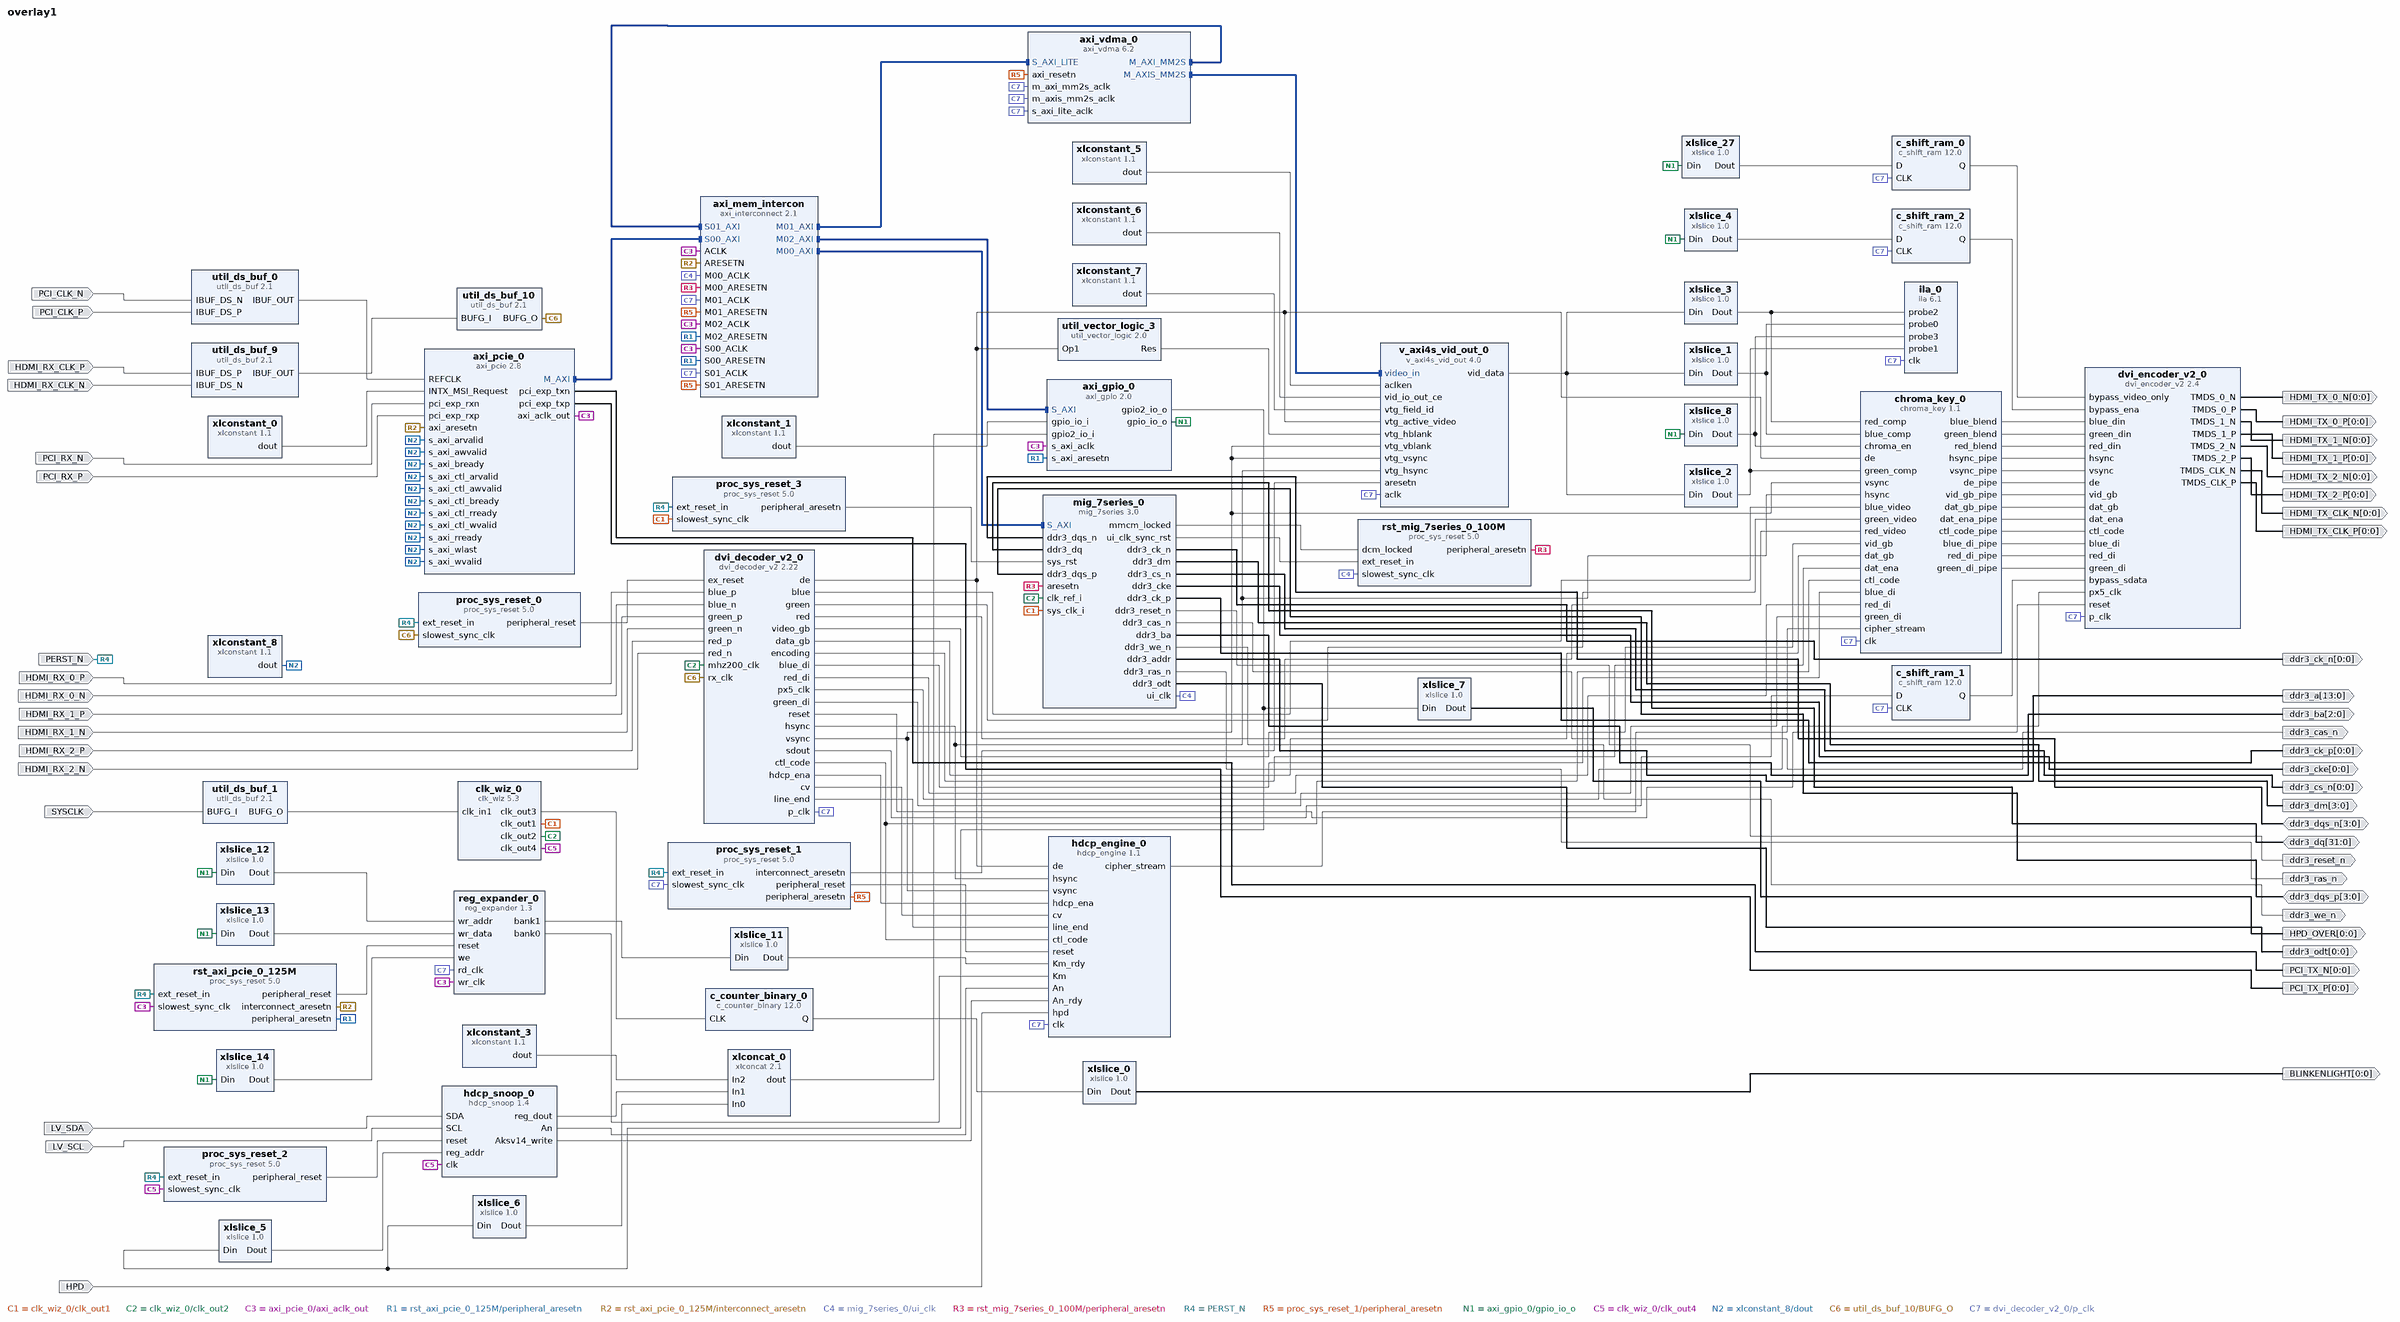
[diagram p0: block diagram of the top level]
# Vivado block design overlay1, Vivado 2016.1
create_bd_design overlay1

create_bd_port -dir O -from 3 -to 0 ddr3_dm
create_bd_port -dir O -from 0 -to 0 ddr3_cs_n
create_bd_port -dir O -from 0 -to 0 -type ce ddr3_cke
create_bd_port -dir O -from 0 -to 0 ddr3_ck_n
create_bd_port -dir O -from 0 -to 0 -type clk ddr3_ck_p
create_bd_port -dir O ddr3_reset_n
create_bd_port -dir O ddr3_we_n
create_bd_port -dir O ddr3_cas_n
create_bd_port -dir O ddr3_ras_n
create_bd_port -dir O -from 2 -to 0 ddr3_ba
create_bd_port -dir O -from 13 -to 0 ddr3_a
create_bd_port -dir IO -from 3 -to 0 ddr3_dqs_n
create_bd_port -dir O -from 0 -to 0 ddr3_odt
create_bd_port -dir I -type clk PCI_CLK_N
set_property -dict {CONFIG.FREQ_HZ 100000000} [get_bd_ports PCI_CLK_N]
create_bd_port -dir I -type clk PCI_CLK_P
set_property -dict {CONFIG.FREQ_HZ 100000000} [get_bd_ports PCI_CLK_P]
create_bd_port -dir I -type clk SYSCLK
set_property -dict {CONFIG.FREQ_HZ 50000000} [get_bd_ports SYSCLK]
create_bd_port -dir I -type rst PERST_N
create_bd_port -dir I PCI_RX_N
create_bd_port -dir I PCI_RX_P
create_bd_port -dir O -from 0 -to 0 PCI_TX_N
create_bd_port -dir O -from 0 -to 0 PCI_TX_P
create_bd_port -dir O -from 0 -to 0 BLINKENLIGHT
create_bd_port -dir IO -from 31 -to 0 -type data ddr3_dq
create_bd_port -dir IO -from 3 -to 0 ddr3_dqs_p
create_bd_port -dir I HDMI_RX_CLK_P
create_bd_port -dir I HDMI_RX_CLK_N
create_bd_port -dir I LV_SDA
create_bd_port -dir I LV_SCL
create_bd_port -dir O -from 0 -to 0 HPD_OVER
create_bd_port -dir O -from 0 -to 0 HDMI_TX_0_P
create_bd_port -dir O -from 0 -to 0 HDMI_TX_0_N
create_bd_port -dir O -from 0 -to 0 HDMI_TX_1_P
create_bd_port -dir O -from 0 -to 0 HDMI_TX_1_N
create_bd_port -dir O -from 0 -to 0 HDMI_TX_2_P
create_bd_port -dir O -from 0 -to 0 HDMI_TX_2_N
create_bd_port -dir O -from 0 -to 0 HDMI_TX_CLK_P
create_bd_port -dir O -from 0 -to 0 HDMI_TX_CLK_N
create_bd_port -dir I HDMI_RX_0_P
create_bd_port -dir I HDMI_RX_0_N
create_bd_port -dir I HDMI_RX_1_P
create_bd_port -dir I HDMI_RX_1_N
create_bd_port -dir I HDMI_RX_2_P
create_bd_port -dir I HDMI_RX_2_N
create_bd_port -dir I HPD

create_bd_cell -type ip -vlnv xilinx.com:ip:axi_pcie:2.8 axi_pcie_0
set_property -dict [list \
  CONFIG.MAX_LINK_SPEED 5.0_GT/s \
  CONFIG.DEVICE_ID 0x7021 \
  CONFIG.BAR1_ENABLED true \
  CONFIG.BAR2_ENABLED true \
  CONFIG.BAR1_TYPE Memory \
  CONFIG.BAR2_TYPE Memory \
  CONFIG.BAR0_SCALE Megabytes \
  CONFIG.BAR1_SCALE Kilobytes \
  CONFIG.BAR2_SCALE Kilobytes \
  CONFIG.BAR0_SIZE 8 \
  CONFIG.BAR1_SIZE 128 \
  CONFIG.BAR2_SIZE 64 \
  CONFIG.PCIEBAR2AXIBAR_1 0x44A00000 \
  CONFIG.PCIEBAR2AXIBAR_2 0x40000000 \
  CONFIG.AXIBAR_AS_0 false \
  CONFIG.AXIBAR_AS_1 true \
  CONFIG.S_AXI_DATA_WIDTH 64 \
  CONFIG.M_AXI_DATA_WIDTH 64 \
  CONFIG.S_AXI_SUPPORTS_NARROW_BURST true \
  CONFIG.BAR_64BIT true \
  CONFIG.AXIBAR_NUM 1 \
  CONFIG.shared_logic_in_core true \
  CONFIG.en_transceiver_status_ports true \
] [get_bd_cells axi_pcie_0]
create_bd_cell -type ip -vlnv xilinx.com:ip:mig_7series:3.0 mig_7series_0
set_property -dict [list \
  CONFIG.XML_INPUT_FILE mig_b.prj \
  CONFIG.RESET_BOARD_INTERFACE Custom \
  CONFIG.MIG_DONT_TOUCH_PARAM Custom \
  CONFIG.BOARD_MIG_PARAM Custom \
] [get_bd_cells mig_7series_0]
create_bd_cell -type ip -vlnv xilinx.com:ip:clk_wiz:5.3 clk_wiz_0
set_property -dict [list \
  CONFIG.PRIM_IN_FREQ 50 \
  CONFIG.CLKIN1_JITTER_PS 200.0 \
  CONFIG.CLKOUT1_USED true \
  CONFIG.CLKOUT2_USED true \
  CONFIG.CLKOUT3_USED true \
  CONFIG.CLKOUT4_USED true \
  CONFIG.NUM_OUT_CLKS 4 \
  CONFIG.CLKOUT1_REQUESTED_OUT_FREQ 400 \
  CONFIG.CLKOUT2_REQUESTED_OUT_FREQ 200 \
  CONFIG.CLKOUT3_REQUESTED_OUT_FREQ 50 \
  CONFIG.CLKOUT4_REQUESTED_OUT_FREQ 25 \
  CONFIG.USE_LOCKED false \
  CONFIG.USE_RESET false \
  CONFIG.RESET_PORT resetn \
  CONFIG.MMCM_DIVCLK_DIVIDE 1 \
  CONFIG.MMCM_CLKFBOUT_MULT_F 20.000 \
  CONFIG.MMCM_CLKIN1_PERIOD 20.0 \
  CONFIG.MMCM_CLKOUT0_DIVIDE_F 2.500 \
  CONFIG.MMCM_CLKOUT1_DIVIDE 5 \
  CONFIG.MMCM_CLKOUT2_DIVIDE 20 \
  CONFIG.MMCM_CLKOUT3_DIVIDE 40 \
  CONFIG.RESET_TYPE ACTIVE_LOW \
  CONFIG.CLKOUT1_JITTER 126.902 \
  CONFIG.CLKOUT1_PHASE_ERROR 164.985 \
  CONFIG.CLKOUT2_JITTER 142.107 \
  CONFIG.CLKOUT2_PHASE_ERROR 164.985 \
  CONFIG.CLKOUT3_JITTER 192.113 \
  CONFIG.CLKOUT3_PHASE_ERROR 164.985 \
  CONFIG.CLKOUT4_JITTER 236.428 \
  CONFIG.CLKOUT4_PHASE_ERROR 164.985 \
] [get_bd_cells clk_wiz_0]
create_bd_cell -type ip -vlnv xilinx.com:ip:util_ds_buf:2.1 util_ds_buf_0
set_property -dict {CONFIG.C_BUF_TYPE IBUFDSGTE} [get_bd_cells util_ds_buf_0]
create_bd_cell -type ip -vlnv xilinx.com:ip:xlconstant:1.1 xlconstant_0
set_property -dict {CONFIG.CONST_VAL 0} [get_bd_cells xlconstant_0]
create_bd_cell -type ip -vlnv xilinx.com:ip:util_ds_buf:2.1 util_ds_buf_1
set_property -dict {CONFIG.C_BUF_TYPE BUFG} [get_bd_cells util_ds_buf_1]
create_bd_cell -type ip -vlnv xilinx.com:ip:axi_interconnect:2.1 axi_mem_intercon
set_property -dict [list \
  CONFIG.NUM_SI 2 \
  CONFIG.NUM_MI 3 \
  CONFIG.STRATEGY 2 \
  CONFIG.ENABLE_ADVANCED_OPTIONS 1 \
  CONFIG.S00_HAS_DATA_FIFO 2 \
  CONFIG.S01_HAS_DATA_FIFO 2 \
] [get_bd_cells axi_mem_intercon]
create_bd_cell -type ip -vlnv xilinx.com:ip:proc_sys_reset:5.0 rst_axi_pcie_0_125M
create_bd_cell -type ip -vlnv xilinx.com:ip:proc_sys_reset:5.0 rst_mig_7series_0_100M
create_bd_cell -type ip -vlnv xilinx.com:ip:c_counter_binary:12.0 c_counter_binary_0
set_property -dict {CONFIG.Output_Width 25 CONFIG.SINIT false} [get_bd_cells c_counter_binary_0]
create_bd_cell -type ip -vlnv xilinx.com:ip:xlslice:1.0 xlslice_0
set_property -dict {CONFIG.DOUT_WIDTH 1 CONFIG.DIN_TO 24 CONFIG.DIN_FROM 24 CONFIG.DIN_WIDTH 25} [get_bd_cells xlslice_0]
create_bd_cell -type ip -vlnv xilinx.com:ip:proc_sys_reset:5.0 proc_sys_reset_0
create_bd_cell -type ip -vlnv xilinx.com:ip:util_ds_buf:2.1 util_ds_buf_9
create_bd_cell -type ip -vlnv xilinx.com:ip:util_ds_buf:2.1 util_ds_buf_10
set_property -dict {CONFIG.C_BUF_TYPE BUFG} [get_bd_cells util_ds_buf_10]
create_bd_cell -type ip -vlnv xilinx.com:ip:axi_vdma:6.2 axi_vdma_0
set_property -dict [list \
  CONFIG.c_m_axis_mm2s_tdata_width 24 \
  CONFIG.c_num_fstores 1 \
  CONFIG.c_use_mm2s_fsync 0 \
  CONFIG.c_mm2s_genlock_mode 0 \
  CONFIG.c_mm2s_linebuffer_depth 512 \
  CONFIG.c_mm2s_max_burst_length 32 \
  CONFIG.c_include_s2mm 0 \
  CONFIG.c_include_mm2s_dre 1 \
] [get_bd_cells axi_vdma_0]
create_bd_cell -type ip -vlnv xilinx.com:ip:v_axi4s_vid_out:4.0 v_axi4s_vid_out_0
set_property -dict [list \
  CONFIG.C_S_AXIS_VIDEO_FORMAT 2 \
  CONFIG.C_HAS_ASYNC_CLK 0 \
  CONFIG.C_ADDR_WIDTH 5 \
  CONFIG.C_VTG_MASTER_SLAVE 1 \
] [get_bd_cells v_axi4s_vid_out_0]
create_bd_cell -type ip -vlnv xilinx.com:ip:xlconstant:1.1 xlconstant_5
create_bd_cell -type ip -vlnv xilinx.com:ip:xlconstant:1.1 xlconstant_6
create_bd_cell -type ip -vlnv xilinx.com:ip:proc_sys_reset:5.0 proc_sys_reset_1
create_bd_cell -type ip -vlnv xilinx.com:ip:axi_gpio:2.0 axi_gpio_0
set_property -dict {CONFIG.C_IS_DUAL 1 CONFIG.C_DOUT_DEFAULT 0x00000001} [get_bd_cells axi_gpio_0]
create_bd_cell -type ip -vlnv xilinx.com:ip:xlslice:1.0 xlslice_4
create_bd_cell -type ip -vlnv xilinx.com:ip:xlconstant:1.1 xlconstant_1
set_property -dict {CONFIG.CONST_WIDTH 32 CONFIG.CONST_VAL 839760574} [get_bd_cells xlconstant_1]
create_bd_cell -type ip -vlnv xilinx.com:ip:xlconstant:1.1 xlconstant_7
set_property -dict {CONFIG.CONST_VAL 0} [get_bd_cells xlconstant_7]
create_bd_cell -type ip -vlnv xilinx.com:ip:xlslice:1.0 xlslice_5
set_property -dict {CONFIG.DOUT_WIDTH 5 CONFIG.DIN_FROM 4} [get_bd_cells xlslice_5]
create_bd_cell -type ip -vlnv xilinx.com:ip:xlslice:1.0 xlslice_6
set_property -dict {CONFIG.DOUT_WIDTH 8 CONFIG.DIN_TO 8 CONFIG.DIN_FROM 15} [get_bd_cells xlslice_6]
create_bd_cell -type ip -vlnv xilinx.com:ip:xlconcat:2.1 xlconcat_0
set_property -dict {CONFIG.NUM_PORTS 3 CONFIG.IN0_WIDTH 8 CONFIG.IN1_WIDTH 8 CONFIG.IN2_WIDTH 16} [get_bd_cells xlconcat_0]
create_bd_cell -type ip -vlnv xilinx.com:ip:xlconstant:1.1 xlconstant_3
set_property -dict {CONFIG.CONST_WIDTH 16 CONFIG.CONST_VAL 47806} [get_bd_cells xlconstant_3]
create_bd_cell -type ip -vlnv xilinx.com:ip:xlslice:1.0 xlslice_7
set_property -dict {CONFIG.DOUT_WIDTH 1 CONFIG.DIN_TO 31 CONFIG.DIN_FROM 31} [get_bd_cells xlslice_7]
create_bd_cell -type ip -vlnv xilinx.com:ip:proc_sys_reset:5.0 proc_sys_reset_2
create_bd_cell -type ip -vlnv xilinx.com:ip:xlconstant:1.1 xlconstant_8
set_property -dict {CONFIG.CONST_VAL 0} [get_bd_cells xlconstant_8]
create_bd_cell -type ip -vlnv xilinx.com:ip:proc_sys_reset:5.0 proc_sys_reset_3
create_bd_cell -type ip -vlnv xilinx.com:ip:xlslice:1.0 xlslice_11
set_property -dict {CONFIG.DIN_TO 0 CONFIG.DIN_FROM 0 CONFIG.DIN_WIDTH 8} [get_bd_cells xlslice_11]
create_bd_cell -type ip -vlnv xilinx.com:ip:xlslice:1.0 xlslice_12
set_property -dict {CONFIG.DOUT_WIDTH 3 CONFIG.DIN_TO 24 CONFIG.DIN_FROM 26} [get_bd_cells xlslice_12]
create_bd_cell -type ip -vlnv xilinx.com:ip:xlslice:1.0 xlslice_13
set_property -dict {CONFIG.DOUT_WIDTH 8 CONFIG.DIN_TO 16 CONFIG.DIN_FROM 23} [get_bd_cells xlslice_13]
create_bd_cell -type ip -vlnv xilinx.com:ip:xlslice:1.0 xlslice_14
set_property -dict {CONFIG.DOUT_WIDTH 1 CONFIG.DIN_TO 31 CONFIG.DIN_FROM 31} [get_bd_cells xlslice_14]
create_bd_cell -type ip -vlnv xilinx.com:ip:util_vector_logic:2.0 util_vector_logic_3
set_property -dict {CONFIG.C_SIZE 1 CONFIG.C_OPERATION not} [get_bd_cells util_vector_logic_3]
create_bd_cell -type ip -vlnv alphamaxmedia.com:bunnie:reg_expander:1.3 reg_expander_0
create_bd_cell -type ip -vlnv alphamaxmedia.com:bunnie:hdcp_engine:1.1 hdcp_engine_0
create_bd_cell -type ip -vlnv alphamaxmedia.com:bunnie:dvi_encoder_v2:2.4 dvi_encoder_v2_0
create_bd_cell -type ip -vlnv xilinx.com:ip:xlslice:1.0 xlslice_27
set_property -dict {CONFIG.DOUT_WIDTH 1 CONFIG.DIN_TO 1 CONFIG.DIN_FROM 1} [get_bd_cells xlslice_27]
create_bd_cell -type ip -vlnv xilinx.com:ip:c_shift_ram:12.0 c_shift_ram_0
set_property -dict {CONFIG.Width 1 CONFIG.Depth 4 CONFIG.DefaultData 0 CONFIG.AsyncInitVal 0} [get_bd_cells c_shift_ram_0]
create_bd_cell -type ip -vlnv xilinx.com:ip:xlslice:1.0 xlslice_1
set_property -dict {CONFIG.DOUT_WIDTH 8 CONFIG.DIN_TO 0 CONFIG.DIN_FROM 7 CONFIG.DIN_WIDTH 24} [get_bd_cells xlslice_1]
create_bd_cell -type ip -vlnv xilinx.com:ip:xlslice:1.0 xlslice_2
set_property -dict {CONFIG.DOUT_WIDTH 8 CONFIG.DIN_TO 8 CONFIG.DIN_FROM 15 CONFIG.DIN_WIDTH 24} [get_bd_cells xlslice_2]
create_bd_cell -type ip -vlnv xilinx.com:ip:xlslice:1.0 xlslice_3
set_property -dict {CONFIG.DOUT_WIDTH 8 CONFIG.DIN_TO 16 CONFIG.DIN_FROM 23 CONFIG.DIN_WIDTH 24} [get_bd_cells xlslice_3]
create_bd_cell -type ip -vlnv xilinx.com:ip:c_shift_ram:12.0 c_shift_ram_1
set_property -dict [list \
  CONFIG.Width 30 \
  CONFIG.Depth 4 \
  CONFIG.DefaultData 000000000000000000000000000000 \
  CONFIG.AsyncInitVal 000000000000000000000000000000 \
] [get_bd_cells c_shift_ram_1]
create_bd_cell -type ip -vlnv xilinx.com:ip:c_shift_ram:12.0 c_shift_ram_2
set_property -dict {CONFIG.Width 1 CONFIG.Depth 4 CONFIG.DefaultData 0 CONFIG.AsyncInitVal 0} [get_bd_cells c_shift_ram_2]
create_bd_cell -type ip -vlnv xilinx.com:ip:xlslice:1.0 xlslice_8
set_property -dict {CONFIG.DOUT_WIDTH 1 CONFIG.DIN_TO 8 CONFIG.DIN_FROM 8} [get_bd_cells xlslice_8]
create_bd_cell -type ip -vlnv alphamaxmedia.com:bunnie:hdcp_snoop:1.4 hdcp_snoop_0
create_bd_cell -type ip -vlnv alphamaxmedia.com:bunnie:dvi_decoder_v2:2.22 dvi_decoder_v2_0
create_bd_cell -type ip -vlnv xilinx.com:ip:ila:6.1 ila_0
set_property -dict [list \
  CONFIG.C_PROBE3_WIDTH 1 \
  CONFIG.C_PROBE2_WIDTH 8 \
  CONFIG.C_PROBE1_WIDTH 8 \
  CONFIG.C_PROBE0_WIDTH 8 \
  CONFIG.C_NUM_OF_PROBES 4 \
  CONFIG.C_ENABLE_ILA_AXI_MON false \
  CONFIG.C_MONITOR_TYPE Native \
] [get_bd_cells ila_0]
create_bd_cell -type ip -vlnv alphamaxmedia.com:bunnie:chroma_key:1.1 chroma_key_0

# ---- connections ----

connect_bd_intf_net [get_bd_intf_pins axi_pcie_0/M_AXI] [get_bd_intf_pins axi_mem_intercon/S00_AXI]
connect_bd_intf_net [get_bd_intf_pins axi_mem_intercon/M00_AXI] [get_bd_intf_pins mig_7series_0/S_AXI]
connect_bd_intf_net [get_bd_intf_pins axi_mem_intercon/M01_AXI] [get_bd_intf_pins axi_vdma_0/S_AXI_LITE]
connect_bd_intf_net [get_bd_intf_pins axi_vdma_0/M_AXI_MM2S] [get_bd_intf_pins axi_mem_intercon/S01_AXI]
connect_bd_intf_net [get_bd_intf_pins axi_vdma_0/M_AXIS_MM2S] [get_bd_intf_pins v_axi4s_vid_out_0/video_in]
connect_bd_intf_net [get_bd_intf_pins axi_mem_intercon/M02_AXI] [get_bd_intf_pins axi_gpio_0/S_AXI]
connect_bd_net [get_bd_pins mig_7series_0/ddr3_dm] [get_bd_ports ddr3_dm]
connect_bd_net [get_bd_pins mig_7series_0/ddr3_cs_n] [get_bd_ports ddr3_cs_n]
connect_bd_net [get_bd_pins mig_7series_0/ddr3_cke] [get_bd_ports ddr3_cke]
connect_bd_net [get_bd_pins mig_7series_0/ddr3_ck_n] [get_bd_ports ddr3_ck_n]
connect_bd_net [get_bd_pins mig_7series_0/ddr3_ck_p] [get_bd_ports ddr3_ck_p]
connect_bd_net [get_bd_pins mig_7series_0/ddr3_reset_n] [get_bd_ports ddr3_reset_n]
connect_bd_net [get_bd_pins mig_7series_0/ddr3_we_n] [get_bd_ports ddr3_we_n]
connect_bd_net [get_bd_pins mig_7series_0/ddr3_cas_n] [get_bd_ports ddr3_cas_n]
connect_bd_net [get_bd_pins mig_7series_0/ddr3_ras_n] [get_bd_ports ddr3_ras_n]
connect_bd_net [get_bd_pins mig_7series_0/ddr3_ba] [get_bd_ports ddr3_ba]
connect_bd_net [get_bd_pins mig_7series_0/ddr3_addr] [get_bd_ports ddr3_a]
connect_bd_net [get_bd_ports ddr3_dqs_n] [get_bd_pins mig_7series_0/ddr3_dqs_n]
connect_bd_net [get_bd_pins mig_7series_0/ddr3_odt] [get_bd_ports ddr3_odt]
connect_bd_net [get_bd_pins clk_wiz_0/clk_out1] [get_bd_pins mig_7series_0/sys_clk_i] [get_bd_pins proc_sys_reset_3/slowest_sync_clk]
connect_bd_net [get_bd_pins clk_wiz_0/clk_out2] [get_bd_pins mig_7series_0/clk_ref_i] [get_bd_pins dvi_decoder_v2_0/mhz200_clk]
connect_bd_net [get_bd_pins util_ds_buf_0/IBUF_OUT] [get_bd_pins axi_pcie_0/REFCLK]
connect_bd_net [get_bd_ports PCI_CLK_N] [get_bd_pins util_ds_buf_0/IBUF_DS_N]
connect_bd_net [get_bd_ports PCI_CLK_P] [get_bd_pins util_ds_buf_0/IBUF_DS_P]
connect_bd_net [get_bd_pins xlconstant_0/dout] [get_bd_pins axi_pcie_0/INTX_MSI_Request]
connect_bd_net [get_bd_pins util_ds_buf_1/BUFG_O] [get_bd_pins clk_wiz_0/clk_in1]
connect_bd_net -net SYSCLK_LV_1 [get_bd_ports SYSCLK] [get_bd_pins util_ds_buf_1/BUFG_I]
connect_bd_net [get_bd_pins axi_pcie_0/axi_aclk_out] \
  [get_bd_pins rst_axi_pcie_0_125M/slowest_sync_clk] [get_bd_pins axi_gpio_0/s_axi_aclk] [get_bd_pins reg_expander_0/wr_clk] \
  [get_bd_pins axi_mem_intercon/S00_ACLK] [get_bd_pins axi_mem_intercon/ACLK] [get_bd_pins axi_mem_intercon/M02_ACLK]
connect_bd_net [get_bd_pins rst_axi_pcie_0_125M/peripheral_aresetn] \
  [get_bd_pins axi_gpio_0/s_axi_aresetn] [get_bd_pins axi_mem_intercon/S00_ARESETN] \
  [get_bd_pins axi_mem_intercon/M02_ARESETN]
connect_bd_net [get_bd_pins rst_axi_pcie_0_125M/interconnect_aresetn] [get_bd_pins axi_pcie_0/axi_aresetn] [get_bd_pins axi_mem_intercon/ARESETN]
connect_bd_net [get_bd_pins mig_7series_0/ui_clk] [get_bd_pins rst_mig_7series_0_100M/slowest_sync_clk] [get_bd_pins axi_mem_intercon/M00_ACLK]
connect_bd_net [get_bd_pins mig_7series_0/mmcm_locked] [get_bd_pins rst_mig_7series_0_100M/dcm_locked]
connect_bd_net [get_bd_pins mig_7series_0/ui_clk_sync_rst] [get_bd_pins rst_mig_7series_0_100M/ext_reset_in]
connect_bd_net [get_bd_pins rst_mig_7series_0_100M/peripheral_aresetn] [get_bd_pins mig_7series_0/aresetn] [get_bd_pins axi_mem_intercon/M00_ARESETN]
connect_bd_net [get_bd_ports PERST_N] \
  [get_bd_pins rst_axi_pcie_0_125M/ext_reset_in] [get_bd_pins proc_sys_reset_1/ext_reset_in] \
  [get_bd_pins proc_sys_reset_2/ext_reset_in] [get_bd_pins proc_sys_reset_3/ext_reset_in] \
  [get_bd_pins proc_sys_reset_0/ext_reset_in]
connect_bd_net [get_bd_ports PCI_RX_N] [get_bd_pins axi_pcie_0/pci_exp_rxn]
connect_bd_net [get_bd_ports PCI_RX_P] [get_bd_pins axi_pcie_0/pci_exp_rxp]
connect_bd_net [get_bd_pins axi_pcie_0/pci_exp_txn] [get_bd_ports PCI_TX_N]
connect_bd_net [get_bd_pins axi_pcie_0/pci_exp_txp] [get_bd_ports PCI_TX_P]
connect_bd_net [get_bd_pins c_counter_binary_0/Q] [get_bd_pins xlslice_0/Din]
connect_bd_net [get_bd_pins xlslice_0/Dout] [get_bd_ports BLINKENLIGHT]
connect_bd_net [get_bd_ports ddr3_dq] [get_bd_pins mig_7series_0/ddr3_dq]
connect_bd_net [get_bd_ports ddr3_dqs_p] [get_bd_pins mig_7series_0/ddr3_dqs_p]
connect_bd_net [get_bd_ports HDMI_RX_CLK_P] [get_bd_pins util_ds_buf_9/IBUF_DS_P]
connect_bd_net [get_bd_ports HDMI_RX_CLK_N] [get_bd_pins util_ds_buf_9/IBUF_DS_N]
connect_bd_net [get_bd_pins util_ds_buf_9/IBUF_OUT] [get_bd_pins util_ds_buf_10/BUFG_I]
connect_bd_net [get_bd_pins xlconstant_5/dout] [get_bd_pins v_axi4s_vid_out_0/aclken]
connect_bd_net [get_bd_pins xlconstant_6/dout] [get_bd_pins v_axi4s_vid_out_0/vid_io_out_ce]
connect_bd_net [get_bd_pins proc_sys_reset_1/peripheral_aresetn] \
  [get_bd_pins axi_vdma_0/axi_resetn] [get_bd_pins axi_mem_intercon/M01_ARESETN] [get_bd_pins axi_mem_intercon/S01_ARESETN]
connect_bd_net [get_bd_pins proc_sys_reset_1/interconnect_aresetn] [get_bd_pins v_axi4s_vid_out_0/aresetn]
connect_bd_net [get_bd_pins axi_gpio_0/gpio_io_o] \
  [get_bd_pins xlslice_4/Din] [get_bd_pins xlslice_12/Din] [get_bd_pins xlslice_13/Din] [get_bd_pins xlslice_14/Din] \
  [get_bd_pins xlslice_27/Din] [get_bd_pins xlslice_8/Din]
connect_bd_net [get_bd_pins xlconstant_1/dout] [get_bd_pins axi_gpio_0/gpio_io_i]
connect_bd_net -net v_tc_0_hblank_out [get_bd_pins util_vector_logic_3/Res] [get_bd_pins v_axi4s_vid_out_0/vtg_hblank]
connect_bd_net [get_bd_pins xlconstant_7/dout] [get_bd_pins v_axi4s_vid_out_0/vtg_field_id]
connect_bd_net [get_bd_pins clk_wiz_0/clk_out4] [get_bd_pins proc_sys_reset_2/slowest_sync_clk] [get_bd_pins hdcp_snoop_0/clk]
connect_bd_net [get_bd_ports LV_SDA] [get_bd_pins hdcp_snoop_0/SDA]
connect_bd_net [get_bd_ports LV_SCL] [get_bd_pins hdcp_snoop_0/SCL]
connect_bd_net [get_bd_pins axi_gpio_0/gpio2_io_o] [get_bd_pins xlslice_5/Din] [get_bd_pins xlslice_6/Din] [get_bd_pins xlslice_7/Din]
connect_bd_net [get_bd_pins xlslice_5/Dout] [get_bd_pins hdcp_snoop_0/reg_addr]
connect_bd_net [get_bd_pins xlconcat_0/dout] [get_bd_pins axi_gpio_0/gpio2_io_i]
connect_bd_net [get_bd_pins xlslice_7/Dout] [get_bd_ports HPD_OVER]
connect_bd_net [get_bd_pins proc_sys_reset_2/peripheral_reset] [get_bd_pins hdcp_snoop_0/reset]
connect_bd_net [get_bd_pins xlconstant_3/dout] [get_bd_pins xlconcat_0/In2]
connect_bd_net [get_bd_pins xlconstant_8/dout] \
  [get_bd_pins axi_pcie_0/s_axi_awvalid] [get_bd_pins axi_pcie_0/s_axi_wlast] [get_bd_pins axi_pcie_0/s_axi_wvalid] \
  [get_bd_pins axi_pcie_0/s_axi_bready] [get_bd_pins axi_pcie_0/s_axi_arvalid] [get_bd_pins axi_pcie_0/s_axi_rready] \
  [get_bd_pins axi_pcie_0/s_axi_ctl_awvalid] [get_bd_pins axi_pcie_0/s_axi_ctl_wvalid] \
  [get_bd_pins axi_pcie_0/s_axi_ctl_bready] [get_bd_pins axi_pcie_0/s_axi_ctl_arvalid] \
  [get_bd_pins axi_pcie_0/s_axi_ctl_rready]
connect_bd_net [get_bd_pins proc_sys_reset_3/peripheral_aresetn] [get_bd_pins mig_7series_0/sys_rst]
connect_bd_net [get_bd_pins dvi_encoder_v2_0/TMDS_0_P] [get_bd_ports HDMI_TX_0_P]
connect_bd_net [get_bd_pins dvi_encoder_v2_0/TMDS_0_N] [get_bd_ports HDMI_TX_0_N]
connect_bd_net [get_bd_pins dvi_encoder_v2_0/TMDS_1_P] [get_bd_ports HDMI_TX_1_P]
connect_bd_net [get_bd_pins dvi_encoder_v2_0/TMDS_1_N] [get_bd_ports HDMI_TX_1_N]
connect_bd_net [get_bd_pins dvi_encoder_v2_0/TMDS_2_P] [get_bd_ports HDMI_TX_2_P]
connect_bd_net [get_bd_pins dvi_encoder_v2_0/TMDS_2_N] [get_bd_ports HDMI_TX_2_N]
connect_bd_net [get_bd_pins dvi_encoder_v2_0/TMDS_CLK_P] [get_bd_ports HDMI_TX_CLK_P]
connect_bd_net [get_bd_pins dvi_encoder_v2_0/TMDS_CLK_N] [get_bd_ports HDMI_TX_CLK_N]
connect_bd_net [get_bd_pins util_ds_buf_10/BUFG_O] [get_bd_pins proc_sys_reset_0/slowest_sync_clk] [get_bd_pins dvi_decoder_v2_0/rx_clk]
connect_bd_net [get_bd_ports HDMI_RX_0_P] [get_bd_pins dvi_decoder_v2_0/blue_p]
connect_bd_net [get_bd_ports HDMI_RX_0_N] [get_bd_pins dvi_decoder_v2_0/blue_n]
connect_bd_net [get_bd_ports HDMI_RX_1_P] [get_bd_pins dvi_decoder_v2_0/green_p]
connect_bd_net [get_bd_ports HDMI_RX_1_N] [get_bd_pins dvi_decoder_v2_0/green_n]
connect_bd_net [get_bd_ports HDMI_RX_2_P] [get_bd_pins dvi_decoder_v2_0/red_p]
connect_bd_net [get_bd_ports HDMI_RX_2_N] [get_bd_pins dvi_decoder_v2_0/red_n]
connect_bd_net [get_bd_pins proc_sys_reset_0/peripheral_reset] [get_bd_pins dvi_decoder_v2_0/ex_reset]
connect_bd_net [get_bd_pins clk_wiz_0/clk_out3] [get_bd_pins c_counter_binary_0/CLK]
connect_bd_net [get_bd_pins dvi_decoder_v2_0/p_clk] \
  [get_bd_pins v_axi4s_vid_out_0/aclk] [get_bd_pins axi_vdma_0/m_axis_mm2s_aclk] \
  [get_bd_pins proc_sys_reset_1/slowest_sync_clk] [get_bd_pins axi_vdma_0/s_axi_lite_aclk] \
  [get_bd_pins axi_vdma_0/m_axi_mm2s_aclk] [get_bd_pins reg_expander_0/rd_clk] [get_bd_pins hdcp_engine_0/clk] \
  [get_bd_pins dvi_encoder_v2_0/p_clk] [get_bd_pins c_shift_ram_0/CLK] [get_bd_pins c_shift_ram_1/CLK] \
  [get_bd_pins c_shift_ram_2/CLK] [get_bd_pins ila_0/clk] [get_bd_pins axi_mem_intercon/M01_ACLK] \
  [get_bd_pins axi_mem_intercon/S01_ACLK] [get_bd_pins chroma_key_0/clk]
connect_bd_net [get_bd_pins dvi_decoder_v2_0/px5_clk] [get_bd_pins dvi_encoder_v2_0/px5_clk]
connect_bd_net [get_bd_pins dvi_decoder_v2_0/reset] [get_bd_pins dvi_encoder_v2_0/reset]
connect_bd_net [get_bd_pins dvi_decoder_v2_0/hsync] \
  [get_bd_pins v_axi4s_vid_out_0/vtg_hsync] [get_bd_pins hdcp_engine_0/hsync] [get_bd_pins chroma_key_0/hsync]
connect_bd_net [get_bd_pins dvi_decoder_v2_0/vsync] \
  [get_bd_pins v_axi4s_vid_out_0/vtg_vsync] [get_bd_pins v_axi4s_vid_out_0/vtg_vblank] [get_bd_pins hdcp_engine_0/vsync] \
  [get_bd_pins chroma_key_0/vsync]
connect_bd_net [get_bd_pins dvi_decoder_v2_0/de] \
  [get_bd_pins v_axi4s_vid_out_0/vtg_active_video] [get_bd_pins util_vector_logic_3/Op1] [get_bd_pins hdcp_engine_0/de] \
  [get_bd_pins chroma_key_0/de]
connect_bd_net [get_bd_pins dvi_decoder_v2_0/ctl_code] [get_bd_pins hdcp_engine_0/ctl_code] [get_bd_pins chroma_key_0/ctl_code]
connect_bd_net [get_bd_pins dvi_decoder_v2_0/hdcp_ena] [get_bd_pins hdcp_engine_0/hdcp_ena]
connect_bd_net [get_bd_pins dvi_decoder_v2_0/cv] [get_bd_pins hdcp_engine_0/cv]
connect_bd_net [get_bd_pins dvi_decoder_v2_0/line_end] [get_bd_pins hdcp_engine_0/line_end]
connect_bd_net [get_bd_pins hdcp_snoop_0/reg_dout] [get_bd_pins xlconcat_0/In1]
connect_bd_net [get_bd_pins hdcp_snoop_0/An] [get_bd_pins hdcp_engine_0/An]
connect_bd_net [get_bd_pins hdcp_snoop_0/Aksv14_write] [get_bd_pins hdcp_engine_0/An_rdy]
connect_bd_net [get_bd_ports HPD] [get_bd_pins hdcp_engine_0/hpd]
connect_bd_net [get_bd_pins reg_expander_0/bank0] [get_bd_pins hdcp_engine_0/Km]
connect_bd_net [get_bd_pins reg_expander_0/bank1] [get_bd_pins xlslice_11/Din]
connect_bd_net [get_bd_pins xlslice_11/Dout] [get_bd_pins hdcp_engine_0/Km_rdy]
connect_bd_net [get_bd_pins xlslice_12/Dout] [get_bd_pins reg_expander_0/wr_addr]
connect_bd_net [get_bd_pins xlslice_13/Dout] [get_bd_pins reg_expander_0/wr_data]
connect_bd_net [get_bd_pins xlslice_14/Dout] [get_bd_pins reg_expander_0/we]
connect_bd_net [get_bd_pins proc_sys_reset_1/peripheral_reset] [get_bd_pins hdcp_engine_0/reset]
connect_bd_net [get_bd_pins rst_axi_pcie_0_125M/peripheral_reset] [get_bd_pins reg_expander_0/reset]
connect_bd_net [get_bd_pins xlslice_6/Dout] [get_bd_pins xlconcat_0/In0]
connect_bd_net [get_bd_pins xlslice_27/Dout] [get_bd_pins c_shift_ram_0/D]
connect_bd_net [get_bd_pins c_shift_ram_0/Q] [get_bd_pins dvi_encoder_v2_0/bypass_video_only]
connect_bd_net [get_bd_pins hdcp_engine_0/cipher_stream] [get_bd_pins chroma_key_0/cipher_stream]
connect_bd_net [get_bd_pins dvi_decoder_v2_0/blue] [get_bd_pins chroma_key_0/blue_video]
connect_bd_net [get_bd_pins dvi_decoder_v2_0/green] [get_bd_pins chroma_key_0/green_video]
connect_bd_net [get_bd_pins dvi_decoder_v2_0/red] [get_bd_pins chroma_key_0/red_video]
connect_bd_net [get_bd_pins dvi_decoder_v2_0/video_gb] [get_bd_pins chroma_key_0/vid_gb]
connect_bd_net [get_bd_pins dvi_decoder_v2_0/data_gb] [get_bd_pins chroma_key_0/dat_gb]
connect_bd_net [get_bd_pins dvi_decoder_v2_0/encoding] [get_bd_pins chroma_key_0/dat_ena]
connect_bd_net [get_bd_pins dvi_decoder_v2_0/blue_di] [get_bd_pins chroma_key_0/blue_di]
connect_bd_net [get_bd_pins dvi_decoder_v2_0/red_di] [get_bd_pins chroma_key_0/red_di]
connect_bd_net [get_bd_pins dvi_decoder_v2_0/green_di] [get_bd_pins chroma_key_0/green_di]
connect_bd_net [get_bd_pins xlslice_1/Dout] [get_bd_pins ila_0/probe0] [get_bd_pins chroma_key_0/blue_comp]
connect_bd_net [get_bd_pins xlslice_2/Dout] [get_bd_pins ila_0/probe1] [get_bd_pins chroma_key_0/green_comp]
connect_bd_net [get_bd_pins xlslice_3/Dout] [get_bd_pins ila_0/probe2] [get_bd_pins chroma_key_0/red_comp]
connect_bd_net [get_bd_pins v_axi4s_vid_out_0/vid_data] [get_bd_pins xlslice_3/Din] [get_bd_pins xlslice_1/Din] [get_bd_pins xlslice_2/Din]
connect_bd_net [get_bd_pins c_shift_ram_1/Q] [get_bd_pins dvi_encoder_v2_0/bypass_sdata]
connect_bd_net [get_bd_pins dvi_decoder_v2_0/sdout] [get_bd_pins c_shift_ram_1/D]
connect_bd_net [get_bd_pins c_shift_ram_2/Q] [get_bd_pins dvi_encoder_v2_0/bypass_ena]
connect_bd_net [get_bd_pins xlslice_4/Dout] [get_bd_pins c_shift_ram_2/D]
connect_bd_net [get_bd_pins chroma_key_0/blue_blend] [get_bd_pins dvi_encoder_v2_0/blue_din]
connect_bd_net [get_bd_pins chroma_key_0/green_blend] [get_bd_pins dvi_encoder_v2_0/green_din]
connect_bd_net [get_bd_pins chroma_key_0/red_blend] [get_bd_pins dvi_encoder_v2_0/red_din]
connect_bd_net [get_bd_pins chroma_key_0/hsync_pipe] [get_bd_pins dvi_encoder_v2_0/hsync]
connect_bd_net [get_bd_pins chroma_key_0/vsync_pipe] [get_bd_pins dvi_encoder_v2_0/vsync]
connect_bd_net [get_bd_pins chroma_key_0/de_pipe] [get_bd_pins dvi_encoder_v2_0/de]
connect_bd_net [get_bd_pins chroma_key_0/vid_gb_pipe] [get_bd_pins dvi_encoder_v2_0/vid_gb]
connect_bd_net [get_bd_pins chroma_key_0/dat_gb_pipe] [get_bd_pins dvi_encoder_v2_0/dat_gb]
connect_bd_net [get_bd_pins chroma_key_0/dat_ena_pipe] [get_bd_pins dvi_encoder_v2_0/dat_ena]
connect_bd_net [get_bd_pins chroma_key_0/ctl_code_pipe] [get_bd_pins dvi_encoder_v2_0/ctl_code]
connect_bd_net [get_bd_pins chroma_key_0/blue_di_pipe] [get_bd_pins dvi_encoder_v2_0/blue_di]
connect_bd_net [get_bd_pins chroma_key_0/red_di_pipe] [get_bd_pins dvi_encoder_v2_0/red_di]
connect_bd_net [get_bd_pins chroma_key_0/green_di_pipe] [get_bd_pins dvi_encoder_v2_0/green_di]
connect_bd_net [get_bd_pins xlslice_8/Dout] [get_bd_pins ila_0/probe3] [get_bd_pins chroma_key_0/chroma_en]

# ---- address map ----
assign_bd_address -offset 0x00000000 -range 512M -target_address_space [get_bd_addr_spaces axi_pcie_0/M_AXI] [get_bd_addr_segs mig_7series_0/memmap/memaddr]
assign_bd_address -offset 0x40000000 -range 64K -target_address_space [get_bd_addr_spaces axi_pcie_0/M_AXI] [get_bd_addr_segs axi_gpio_0/S_AXI/Reg]
assign_bd_address -offset 0x44A00000 -range 128K -target_address_space [get_bd_addr_spaces axi_pcie_0/M_AXI] [get_bd_addr_segs axi_vdma_0/S_AXI_LITE/Reg]
assign_bd_address -offset 0x00000000 -range 512M -target_address_space [get_bd_addr_spaces axi_vdma_0/Data_MM2S] [get_bd_addr_segs mig_7series_0/memmap/memaddr]
exclude_bd_addr_seg -offset 0x40000000 -range 64K -target_address_space [get_bd_addr_spaces axi_vdma_0/Data_MM2S] [get_bd_addr_segs axi_gpio_0/S_AXI/Reg]
exclude_bd_addr_seg -offset 0x44A00000 -range 64K -target_address_space [get_bd_addr_spaces axi_vdma_0/Data_MM2S] [get_bd_addr_segs axi_vdma_0/S_AXI_LITE/Reg]

validate_bd_design
save_bd_design
